# Altium schematic sheet TopLevel.SchDoc (part 3 of 3)
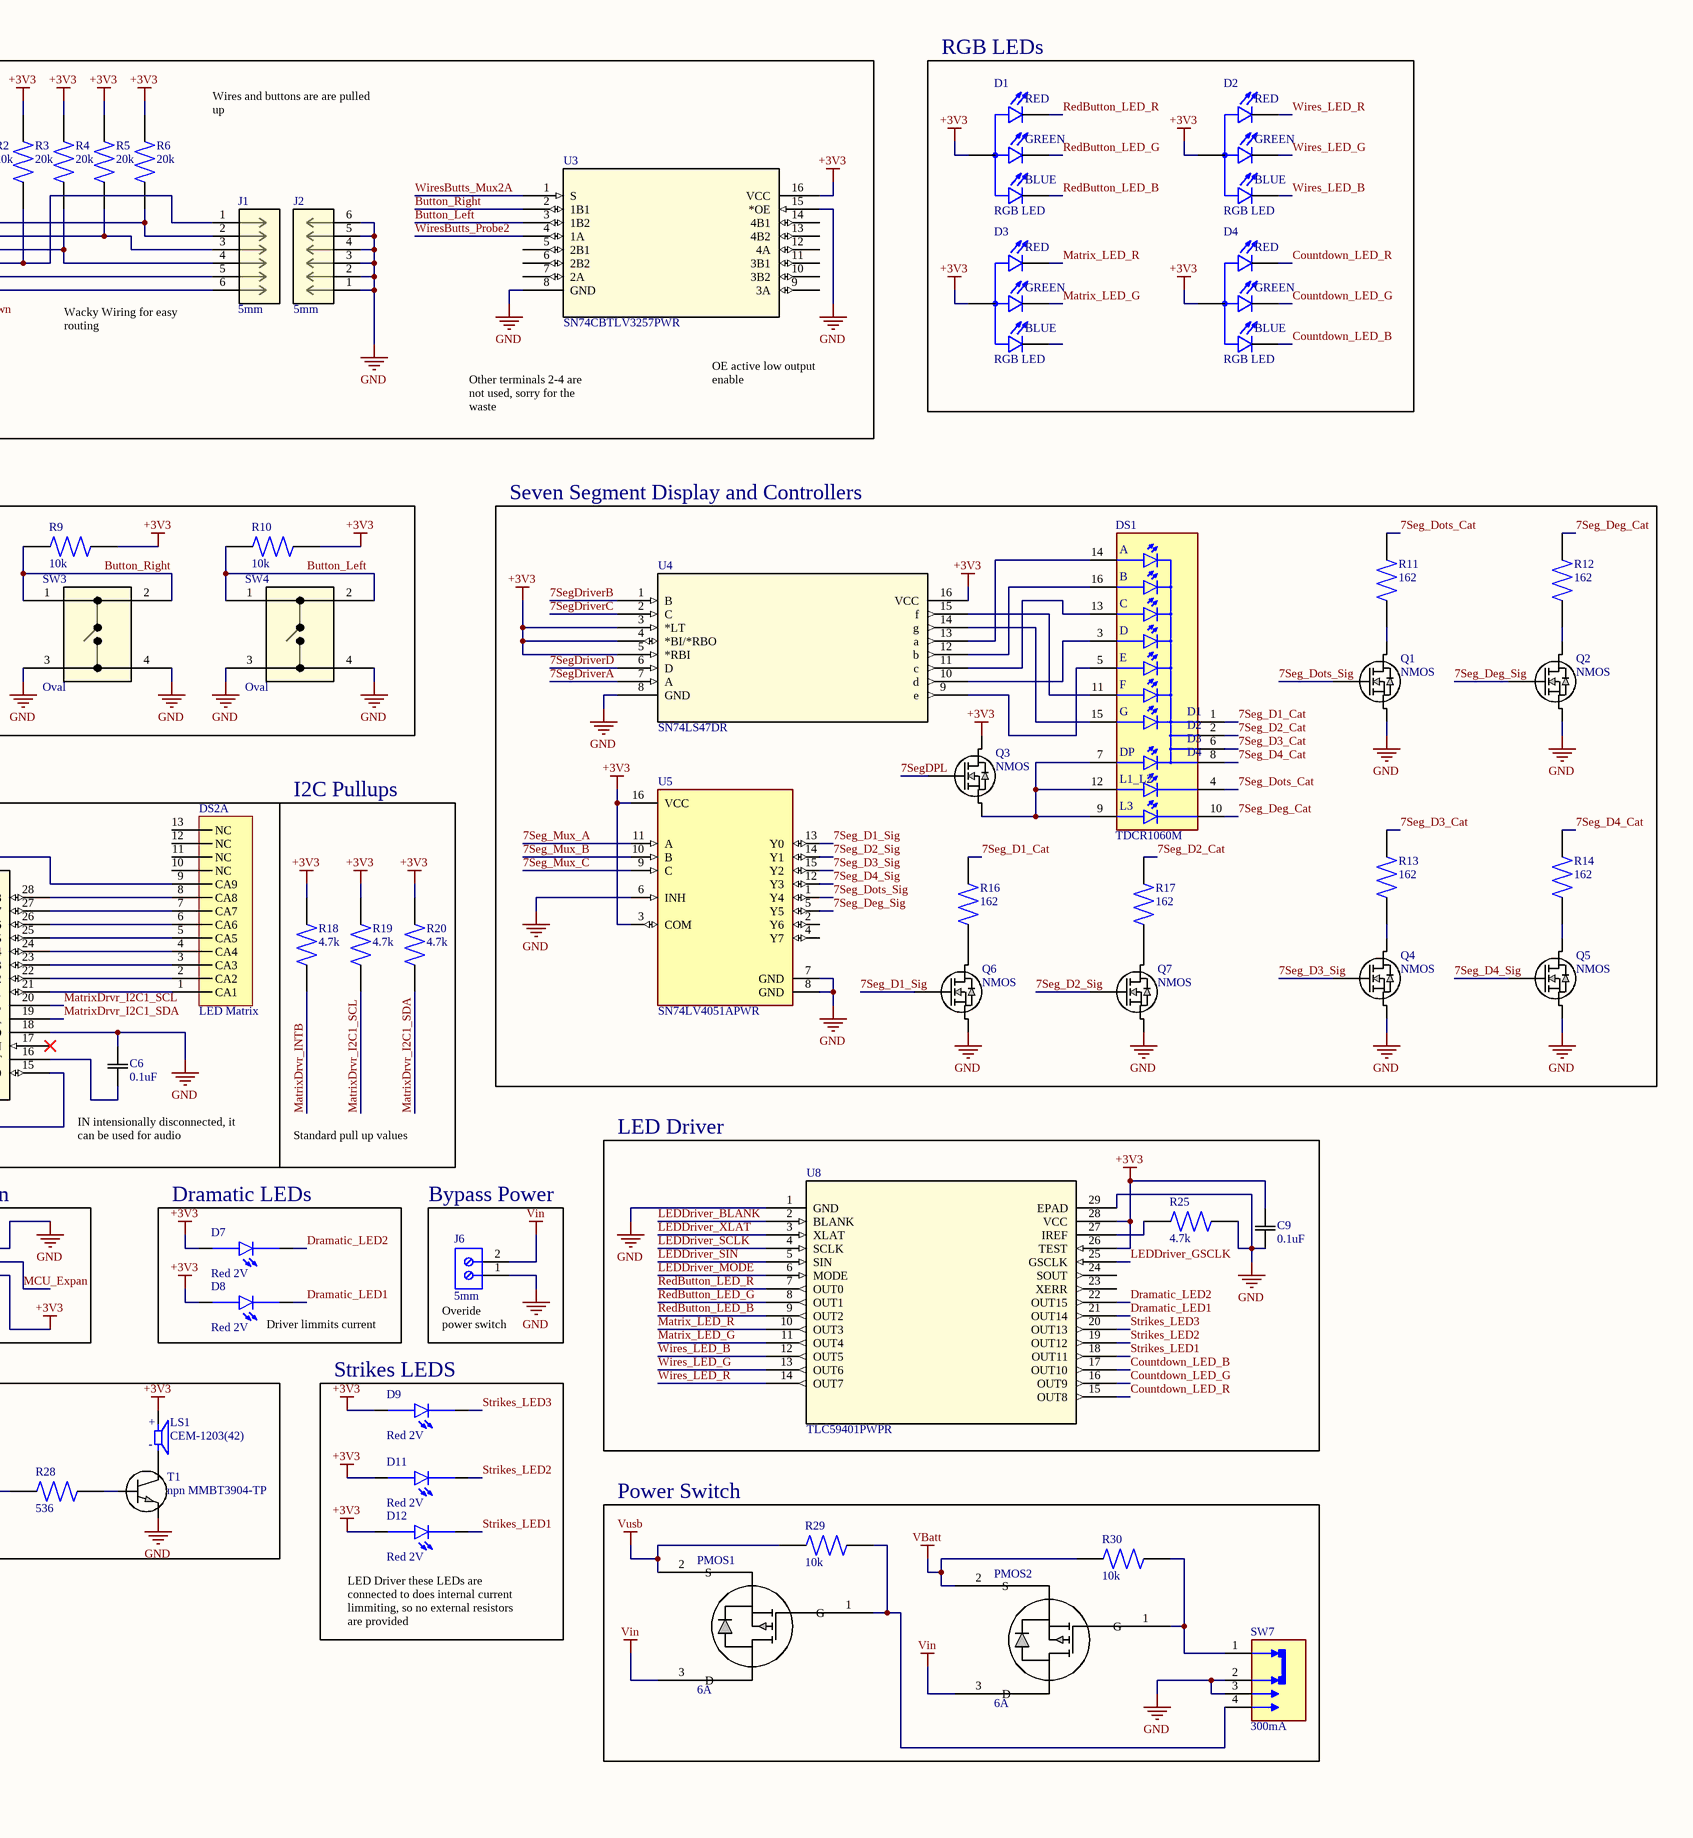
[diagram p3: TopLevel.SchDoc, right]

## Library data of the parts (continued)
U2 U5 = IC MUX 8:1 SN74LV4051APWR: Single-Ended Multiplexer, 1 Func, 8 Channel, CMOS, PDSO16; Manufacturer: Texas Instruments; Package Body Material: Plastic; Number of Channels: 8; Channels: 1; Off-state Isolation-Nom: 45dB; On-state Resistance Match-Nom: 2.1R; On-state Resistance-Max (Ron): 180R; Package Equivalence Code: TSSOP16,.25; Power Supplies: 3.3V; Signal Current-Max: 50mA; Supply Current-Max (Isup): 20uA; Max Supply Voltage: 5.5V; Min Supply Voltage: 2V; Nominal Supply Voltage: 2.3V; Switch-off Time-Max: 28ns; Qualification Status: Not Qualified; Supplier: Digikey; Supplier Part Number: 296-3829-1-ND; Manufacturer Part Number: SN74LV4051APWR; RoHS: Yes; Category: Decoders and Multiplexers; Stock: 20567; Pricing: 1=0.27, 10=0.189, 25=0.1672, 100=0.1435, 250=0.13224, 500=0.12538, 1000=0.11977 (USD); Case/Package: TSSOP; Pins: 16; Package Shape: Rectangular; Terminal Finish: Tin; Min Operating Temperature: -40°C; Max Operating Temperature: 85°C; JESD-609 Code: e3; Throw Configuration: SINGLE-ENDED MULTIPLEXER; JESD-30 Code: R-PDSO-G16; Moisture Sensitivity Level: 1; Package Style: SMALL OUTLINE, THIN PROFILE, SHRINK PITCHMeter; Peak Reflow Temperature (Cel): 260°C; Surface Mount: Yes; Switch-on Time-Max: 28ns; Technology: CMOS; Terminal Form: Gull Wing; Terminal Position: DUAL; Length: 5mm; Width: 4.4mm; Height - Seated (Max): 1.2mm; Terminal Pitch: 0.65mm; Temperature Grade: INDUSTRIAL; Reach SVHC Compliant: Yes; RoHS Compliant: Yes; ComponentLink1URL: https://www.ti.com:443/lit/ds/symlink/sn74lv4051a.pdf?src-supplier=IHS+Markit; ComponentLink1Description: https://www.ti.com:443/lit/ds/symlink/sn74lv4051a.pdf?src-supplier=IHS+Markit; ComponentLink2URL: https://datasheet.ciiva.com/27051/1026350-27051257.pdf?src-supplier=Jameco; ComponentLink2Description: https://datasheet.ciiva.com/27051/1026350-27051257.pdf?src-supplier=Jameco; ComponentLink3URL: https://datasheet.ciiva.com/15127/getdatasheetpartid-300450-15127659.pdf?src-supplier=Verical; ComponentLink3Description: https://datasheet.ciiva.com/15127/getdatasheetpartid-300450-15127659.pdf?src-supplier=Verical; ComponentLink4URL: https://datasheet.ciiva.com/1669/sn74lv4051a-1669786.pdf?src-supplier=Digikey; ComponentLink4Description: https://datasheet.ciiva.com/1669/sn74lv4051a-1669786.pdf?src-supplier=Digikey; ComponentLink5URL: https://datasheet.ciiva.com/1669/sn74lv4051a-1669787.pdf?src-supplier=Digikey; ComponentLink5Description: https://datasheet.ciiva.com/1669/sn74lv4051a-1669787.pdf?src-supplier=Digikey; ComponentLink6URL: https://datasheet.ciiva.com/1669/sn74lv4051a-1669788.pdf?src-supplier=Digikey; ComponentLink6Description: https://datasheet.ciiva.com/1669/sn74lv4051a-1669788.pdf?src-supplier=Digikey; ComponentLink7URL: https://datasheet.ciiva.com/2980/sn74lv4051a-2980182.pdf?src-supplier=Avnet; ComponentLink7Description: https://datasheet.ciiva.com/2980/sn74lv4051a-2980182.pdf?src-supplier=Avnet; ComponentLink8URL: https://datasheet.ciiva.com/48711/001048021-da-01-en-ic-de-mux-8x-sn74lv4051apwr-tssop-16-tid-48711975.pdf?src-supplier=Conrad; ComponentLink8Description: https://datasheet.ciiva.com/48711/001048021-da-01-en-ic-de-mux-8x-sn74lv4051apwr-tssop-16-tid-48711975.pdf?src-supplier=Conrad
U3 = IC 1:2 Switch SN74CBTLV3257PWR: Multiplexer And Demux/Decoder, CBTLV/3B Series, 4-Func, 1 Line Input, 2 Line Output, True Output, CMOS, PDSO16; Manufacturer: Texas Instruments; Package Body Material: Plastic; Channels: 4; Number of Inputs: 1; Number of Outputs: 2; Output Characteristics: 3-STATE; Package Equivalence Code: TSSOP16,.25; Power Supplies: 2.5/3.3V; Propagation Delay (tpd): 0.25ns; Max Supply Voltage: 3.6V; Min Supply Voltage: 2.3V; Nominal Supply Voltage: 2.5V; Qualification Status: Not Qualified; Supplier: Digikey; Supplier Part Number: 296-9138-1-ND; Manufacturer Part Number: SN74CBTLV3257PWR; RoHS: Yes; Category: Decoders and Multiplexers; Stock: 30419; Pricing: 1=0.45, 10=0.314, 25=0.2804, 100=0.2431, 250=0.22532, 500=0.21458, 1000=0.20655 (USD); Case/Package: TSSOP; Pins: 16; Package Shape: Rectangular; Terminal Finish: Tin; Min Operating Temperature: -40°C; Max Operating Temperature: 85°C; JESD-609 Code: e3; Output Polarity: True; JESD-30 Code: R-PDSO-G16; Logic Type: MULTIPLEXER AND DEMUX/DECODER; Moisture Sensitivity Level: 1; Package Style: SMALL OUTLINE, THIN PROFILE, SHRINK PITCHMeter; Peak Reflow Temperature (Cel): 260°C; Surface Mount: Yes; Technology: CMOS; Terminal Form: Gull Wing; Terminal Position: DUAL; Length: 5mm; Width: 4.4mm; Height - Seated (Max): 1.2mm; Terminal Pitch: 0.65mm; Temperature Grade: INDUSTRIAL; Reach SVHC Compliant: Yes; RoHS Compliant: Yes; ComponentLink1URL: https://www.ti.com:443/lit/ds/symlink/sn74cbtlv3257.pdf?src-supplier=IHS+Markit; ComponentLink1Description: https://www.ti.com:443/lit/ds/symlink/sn74cbtlv3257.pdf?src-supplier=IHS+Markit; ComponentLink2URL: https://datasheet.ciiva.com/15096/getdatasheetpartid-475832-15096886.pdf?src-supplier=Verical; ComponentLink2Description: https://datasheet.ciiva.com/15096/getdatasheetpartid-475832-15096886.pdf?src-supplier=Verical; ComponentLink3URL: https://datasheet.ciiva.com/34301/914507-34301751.pdf?src-supplier=Jameco; ComponentLink3Description: https://datasheet.ciiva.com/34301/914507-34301751.pdf?src-supplier=Jameco; ComponentLink4URL: https://datasheet.ciiva.com/41457/001016561-da-01-en-ic-4b-1of-sn74cbtlv3257pwr-tssop-16-tid-41457145.pdf?src-supplier=Conrad; ComponentLink4Description: https://datasheet.ciiva.com/41457/001016561-da-01-en-ic-4b-1of-sn74cbtlv3257pwr-tssop-16-tid-41457145.pdf?src-supplier=Conrad; ComponentLink5URL: https://datasheet.ciiva.com/1509/1634002-1509116.pdf?src-supplier=Element14; ComponentLink5Description: https://datasheet.ciiva.com/1509/1634002-1509116.pdf?src-supplier=Element14; ComponentLink6URL: https://datasheet.ciiva.com/46395/1882419-46395595.pdf?src-supplier=Element14; ComponentLink6Description: https://datasheet.ciiva.com/46395/1882419-46395595.pdf?src-supplier=Element14; ComponentLink7URL: https://datasheet.ciiva.com/3169/sn74cbtlv3257-3169116.pdf?src-supplier=Avnet; ComponentLink7Description: https://datasheet.ciiva.com/3169/sn74cbtlv3257-3169116.pdf?src-supplier=Avnet; ComponentLink8URL: https://datasheet.ciiva.com/3169/sn74cbtlv3257-3169117.pdf?src-supplier=Avnet; ComponentLink8Description: https://datasheet.ciiva.com/3169/sn74cbtlv3257-3169117.pdf?src-supplier=Avnet; ComponentLink9URL: https://datasheet.ciiva.com/1888/sn74cbtlv3257-1888771.pdf?src-supplier=Digikey; ComponentLink9Description: https://datasheet.ciiva.com/1888/sn74cbtlv3257-1888771.pdf?src-supplier=Digikey; ComponentLink10URL: https://datasheet.ciiva.com/1888/sn74cbtlv3257-1888772.pdf?src-supplier=Digikey; ComponentLink10Description: https://datasheet.ciiva.com/1888/sn74cbtlv3257-1888772.pdf?src-supplier=Digikey; ComponentLink11URL: https://datasheet.ciiva.com/1888/sn74cbtlv3257-1888773.pdf?src-supplier=Digikey; ComponentLink11Description: https://datasheet.ciiva.com/1888/sn74cbtlv3257-1888773.pdf?src-supplier=Digikey
U4 = IC DRVR 7 SEG SN74LS47DR: Seven Segment Decoder/Driver, LS Series, Inverted Output, TTL, PDSO16; Manufacturer: Texas Instruments; Package Body Material: Plastic; Input Conditioning: STANDARD; Load Capacitance (CL): 15pF; Channels: 1; Output Characteristics: OPEN-COLLECTOR; Power Supply Current-Max (ICC): 13mA; Propagation Delay (tpd): 100ns; Max Supply Voltage: 5.5V; Min Supply Voltage: 4.75V; Nominal Supply Voltage: 5V; Qualification Status: Not Qualified; Supplier: Digikey; Supplier Part Number: 296-46894-1-ND; Manufacturer Part Number: SN74LS47DR; RoHS: Yes; Category: Integrated Circuits (ICs); Stock: 3469; Pricing: 1=1.33, 10=0.967, 25=0.876, 100=0.7762, 250=0.72848, 500=0.70992 (USD); Case/Package: SOP; Pins: 16; Package Shape: Rectangular; Terminal Finish: Nickel; Min Operating Temperature: 0°C; Max Operating Temperature: 70°C; JESD-609 Code: e4; Output Polarity: INVERTED; JESD-30 Code: R-PDSO-G16; Logic Type: SEVEN SEGMENT DECODER/DRIVER; Moisture Sensitivity Level: 1; Package Style: SMALL OUTLINEMeter; Peak Reflow Temperature (Cel): 260°C; Surface Mount: Yes; Technology: TTL; Terminal Form: Gull Wing; Terminal Position: DUAL; Length: 9.9mm; Width: 3.9mm; Height - Seated (Max): 1.75mm; Terminal Pitch: 1.27mm; Temperature Grade: COMMERCIAL; Reach SVHC Compliant: Yes; RoHS Compliant: Yes; ComponentLink1URL: https://www.ti.com:443/lit/ds/symlink/sn5447a.pdf?src-supplier=IHS+Markit; ComponentLink1Description: https://www.ti.com:443/lit/ds/symlink/sn5447a.pdf?src-supplier=IHS+Markit; ComponentLink2URL: https://datasheet.ciiva.com/14293/sn74ls47-14293676.pdf?src-supplier=Avnet; ComponentLink2Description: https://datasheet.ciiva.com/14293/sn74ls47-14293676.pdf?src-supplier=Avnet
U6 = IC MatrixDriv IS31FL3731-SALS2-TR: LED Driver, 144-Segment, PDSO28; Manufacturer: ISSI; Interface IC Type: LED DISPLAY DRIVER; Supplier: Digikey; Supplier Part Number: 2521-IS31FL3731-SALS2-TRCT-ND; Manufacturer Part Number: IS31FL3731-SALS2-TR; RoHS: Yes; Category: Integrated Circuits (ICs); Stock: 791; Pricing: 1=2.67, 10=1.682, 25=1.4248, 100=1.1332, 250=0.99012, 500=0.90206, 1000=0.82831 (USD); Reach SVHC Compliant: Yes; RoHS Compliant: Yes
U7 = IC LIN REG 3V3 LDL1117S33R: Fixed Positive LDO Regulator, 3.3V, 0.6V Dropout, PDSO4; Manufacturer: STMicroelectronics; Package Body Material: Plastic; Channels: 1; Dropout Voltage1-Max: 600mV; Max Supply Voltage: 18V; Min Input Voltage: 4.3V; Output Current1-Max: 1.2A; Output Voltage1-Max: 3.399V; Output Voltage1-Min: 3.201V; Regulator Type: FIXED POSITIVE SINGLE OUTPUT LDO REGULATOR; Supplier: Digikey; Supplier Part Number: 497-17239-1-ND; Manufacturer Part Number: LDL1117S33R; RoHS: Yes; Category: Voltage Regulators - Linear; Stock: 71269; Pricing: 1=0.36, 10=0.251, 25=0.2232, 100=0.1926, 250=0.178, 500=0.16922, 1000=0.16199 (USD); Case/Package: SOP; Pins: 4; Package Shape: Rectangular; Package Style: SMALL OUTLINEMeter; Surface Mount: Yes; JESD-30 Code: R-PDSO-G4; Operating Temperature, TJ-Max: 125°C; Operating Temperature, TJ-Min: -40°C; Output Voltage1-Nom: 3.3V; Terminal Form: Gull Wing; Terminal Position: DUAL; Length: 6.5mm; Width: 3.5mm; Height - Seated (Max): 1.9mm; Terminal Pitch: 2.3mm; Reach SVHC Compliant: Yes; RoHS Compliant: Yes; ComponentLink1URL: https://datasheet.ciiva.com:443/pdfs/VipMasterIC/IC/SGST/SGST-S-A0010030722/SGST-S-A0010030722-1.pdf?src-supplier=IHS+Markit; ComponentLink1Description: https://datasheet.ciiva.com:443/pdfs/VipMasterIC/IC/SGST/SGST-S-A0010030722/SGST-S-A0010030722-1.pdf?src-supplier=IHS+Markit; ComponentLink2URL: http://www.farnell.com/datasheets/2259188.pdf?src-supplier=Farnell; ComponentLink2Description: http://www.farnell.com/datasheets/2259188.pdf?src-supplier=Farnell; ComponentLink3URL: http://www.st.com/content/ccc/resource/technical/document/datasheet/group3/0e/5a/00/ca/10/1a/4f/a5/DM00366442/files/DM00366442.pdf/jcr:content/translations/en.DM00366442.pdf?src-supplier=Digikey; ComponentLink3Description: http://www.st.com/content/ccc/resource/technical/document/datasheet/group3/0e/5a/00/ca/10/1a/4f/a5/DM00366442/files/DM00366442.pdf/jcr:content/translations/en.DM00366442.pdf?src-supplier=Digikey; ComponentLink4URL: http://www.farnell.com/datasheets/2259188.pdf?src-supplier=Element14; ComponentLink4Description: http://www.farnell.com/datasheets/2259188.pdf?src-supplier=Element14
U8 = IC 16LED Driver TLC59401PWPR: LED Driver, 16-Segment, PDSO28; Manufacturer: Texas Instruments; Package Body Material: Plastic; Data Input Mode: SERIAL; fmax-Min: 30MHz; Interface IC Type: LED DISPLAY DRIVER; Multiplexed Display Capability: No; Channels: 1; Number of Segments: 16; Package Equivalence Code: TSSOP28,.25; Power Supplies: 3.3/5V; Max Supply Voltage: 5.5V; Min Supply Voltage: 3V; Nominal Supply Voltage: 5V; Qualification Status: Not Qualified; Supplier: Digikey; Supplier Part Number: 296-25565-1-ND; Manufacturer Part Number: TLC59401PWPR; RoHS: Yes; Category: LED Drivers; Stock: 2649; Pricing: 1=2.56, 10=1.902, 25=1.7388, 100=1.5588, 250=1.47304, 500=1.42132, 1000=1.37876 (USD); Case/Package: HTSSOP; Pins: 28; Package Shape: Rectangular; Terminal Finish: Nickel; Min Operating Temperature: -40°C; Max Operating Temperature: 85°C; JESD-609 Code: e4; JESD-30 Code: R-PDSO-G28; Moisture Sensitivity Level: 2; Package Style: SMALL OUTLINEMeter; Peak Reflow Temperature (Cel): 260°C; Surface Mount: Yes; Terminal Form: Gull Wing; Terminal Position: DUAL; Length: 9.7mm; Width: 4.4mm; Height - Seated (Max): 1.2mm; Terminal Pitch: 0.65mm; Temperature Grade: INDUSTRIAL; Reach SVHC Compliant: Yes; RoHS Compliant: Yes; ComponentLink1URL: https://www.ti.com:443/lit/ds/symlink/tlc59401.pdf?src-supplier=IHS+Markit; ComponentLink1Description: https://www.ti.com:443/lit/ds/symlink/tlc59401.pdf?src-supplier=IHS+Markit; ComponentLink2URL: https://datasheet.ciiva.com/1945/tlc59401-1945872.pdf?src-supplier=Digikey; ComponentLink2Description: https://datasheet.ciiva.com/1945/tlc59401-1945872.pdf?src-supplier=Digikey; ComponentLink3URL: https://datasheet.ciiva.com/15135/getdatasheetpartid-530850-15135421.pdf?src-supplier=Verical; ComponentLink3Description: https://datasheet.ciiva.com/15135/getdatasheetpartid-530850-15135421.pdf?src-supplier=Verical; ComponentLink4URL: https://datasheet.ciiva.com/3165/tlc59401-3165430.pdf?src-supplier=Avnet; ComponentLink4Description: https://datasheet.ciiva.com/3165/tlc59401-3165430.pdf?src-supplier=Avnet; ComponentLink5URL: https://datasheet.ciiva.com/1945/tlc59401-1945871.pdf?src-supplier=Digikey; ComponentLink5Description: https://datasheet.ciiva.com/1945/tlc59401-1945871.pdf?src-supplier=Digikey; ComponentLink6URL: https://datasheet.ciiva.com/1945/tlc59401-1945873.pdf?src-supplier=Digikey; ComponentLink6Description: https://datasheet.ciiva.com/1945/tlc59401-1945873.pdf?src-supplier=Digikey
U9 = IC USB Dual ESD Protec IP4220CZ6,125: Trans Voltage Suppressor Diode, Unidirectional, 1 Element, Silicon; Manufacturer: Nexperia; Package Body Material: Plastic; Max Breakdown Voltage: 9V; Min Breakdown Voltage: 6V; Number of Elements: 1; Time @ Peak Reflow Temperature-Max (s): 30s; Supplier: Digikey; Supplier Part Number: 1727-3578-1-ND; Manufacturer Part Number: IP4220CZ6,125; RoHS: Yes; Category: TVS Diodes; Stock: 42341; Pricing: 1=0.28, 10=0.223, 100=0.172, 500=0.148, 1000=0.11031 (USD); Pins: 6; Diode Element Material: SILICON; Package Shape: Rectangular; Terminal Finish: Tin; JESD-609 Code: e3; Polarity: Unidirectional; Diode Type: TRANS VOLTAGE SUPPRESSOR; JESD-30 Code: R-PDSO-G6; Moisture Sensitivity Level: 1; Package Style: SMALL OUTLINEMeter; Peak Reflow Temperature (Cel): 260°C; Surface Mount: Yes; Technology: ZENER; Terminal Form: Gull Wing; Terminal Position: DUAL; Reach SVHC Compliant: Yes; RoHS Compliant: Yes; ComponentLink1URL: https://datasheet.ciiva.com:443/pdfs/VipMasterIC/IC/NEXP/NEXP-S-A0003060256/NEXP-S-A0003059736-1.pdf?src-supplier=IHS+Markit; ComponentLink1Description: https://datasheet.ciiva.com:443/pdfs/VipMasterIC/IC/NEXP/NEXP-S-A0003060256/NEXP-S-A0003059736-1.pdf?src-supplier=IHS+Markit; ComponentLink2URL: http://www.farnell.com/datasheets/1708221.pdf?src-supplier=Farnell; ComponentLink2Description: http://www.farnell.com/datasheets/1708221.pdf?src-supplier=Farnell; ComponentLink3URL: https://assets.nexperia.com/documents/data-sheet/IP4220CZ6.pdf?src-supplier=Digikey; ComponentLink3Description: https://assets.nexperia.com/documents/data-sheet/IP4220CZ6.pdf?src-supplier=Digikey
X1 = OSC 16MHz 18pF: Crystal 16MHz ±20ppm (Tol) ±50ppm (Stability) 18pF FUND 40Ohm 2-Pin HC-49/US SMD T/R; Manufacturer: Abracon; Manufacturer Part Number: ABLS-16.000MHZ-B2-T; Supplier: Digikey; Supplier Part Number: 535-9071-1-ND; RoHS: Yes; Category: Crystals; Stock: 544; Pricing: 1=0.25, 10=0.217, 50=0.1972, 100=0.189, 500=0.16892 (USD); ComponentLink1URL: https://datasheet.ciiva.com/854/abls-854315.pdf?src-supplier=Digikey; ComponentLink1Description: https://datasheet.ciiva.com/854/abls-854315.pdf?src-supplier=Digikey; ComponentLink2URL: https://datasheet.ciiva.com/854/abls-854316.pdf?src-supplier=Digikey; ComponentLink2Description: https://datasheet.ciiva.com/854/abls-854316.pdf?src-supplier=Digikey; ComponentLink3URL: https://datasheet.ciiva.com/854/abls-854317.pdf?src-supplier=Digikey; ComponentLink3Description: https://datasheet.ciiva.com/854/abls-854317.pdf?src-supplier=Digikey; ComponentLink4URL: https://datasheet.ciiva.com/4944/abls-44621-4944490.pdf?src-supplier=Mouser; ComponentLink4Description: https://datasheet.ciiva.com/4944/abls-44621-4944490.pdf?src-supplier=Mouser; ComponentLink5URL: https://datasheet.ciiva.com/16373/abls-16373302.pdf?src-supplier=Future+Electronics; ComponentLink5Description: https://datasheet.ciiva.com/16373/abls-16373302.pdf?src-supplier=Future+Electronics